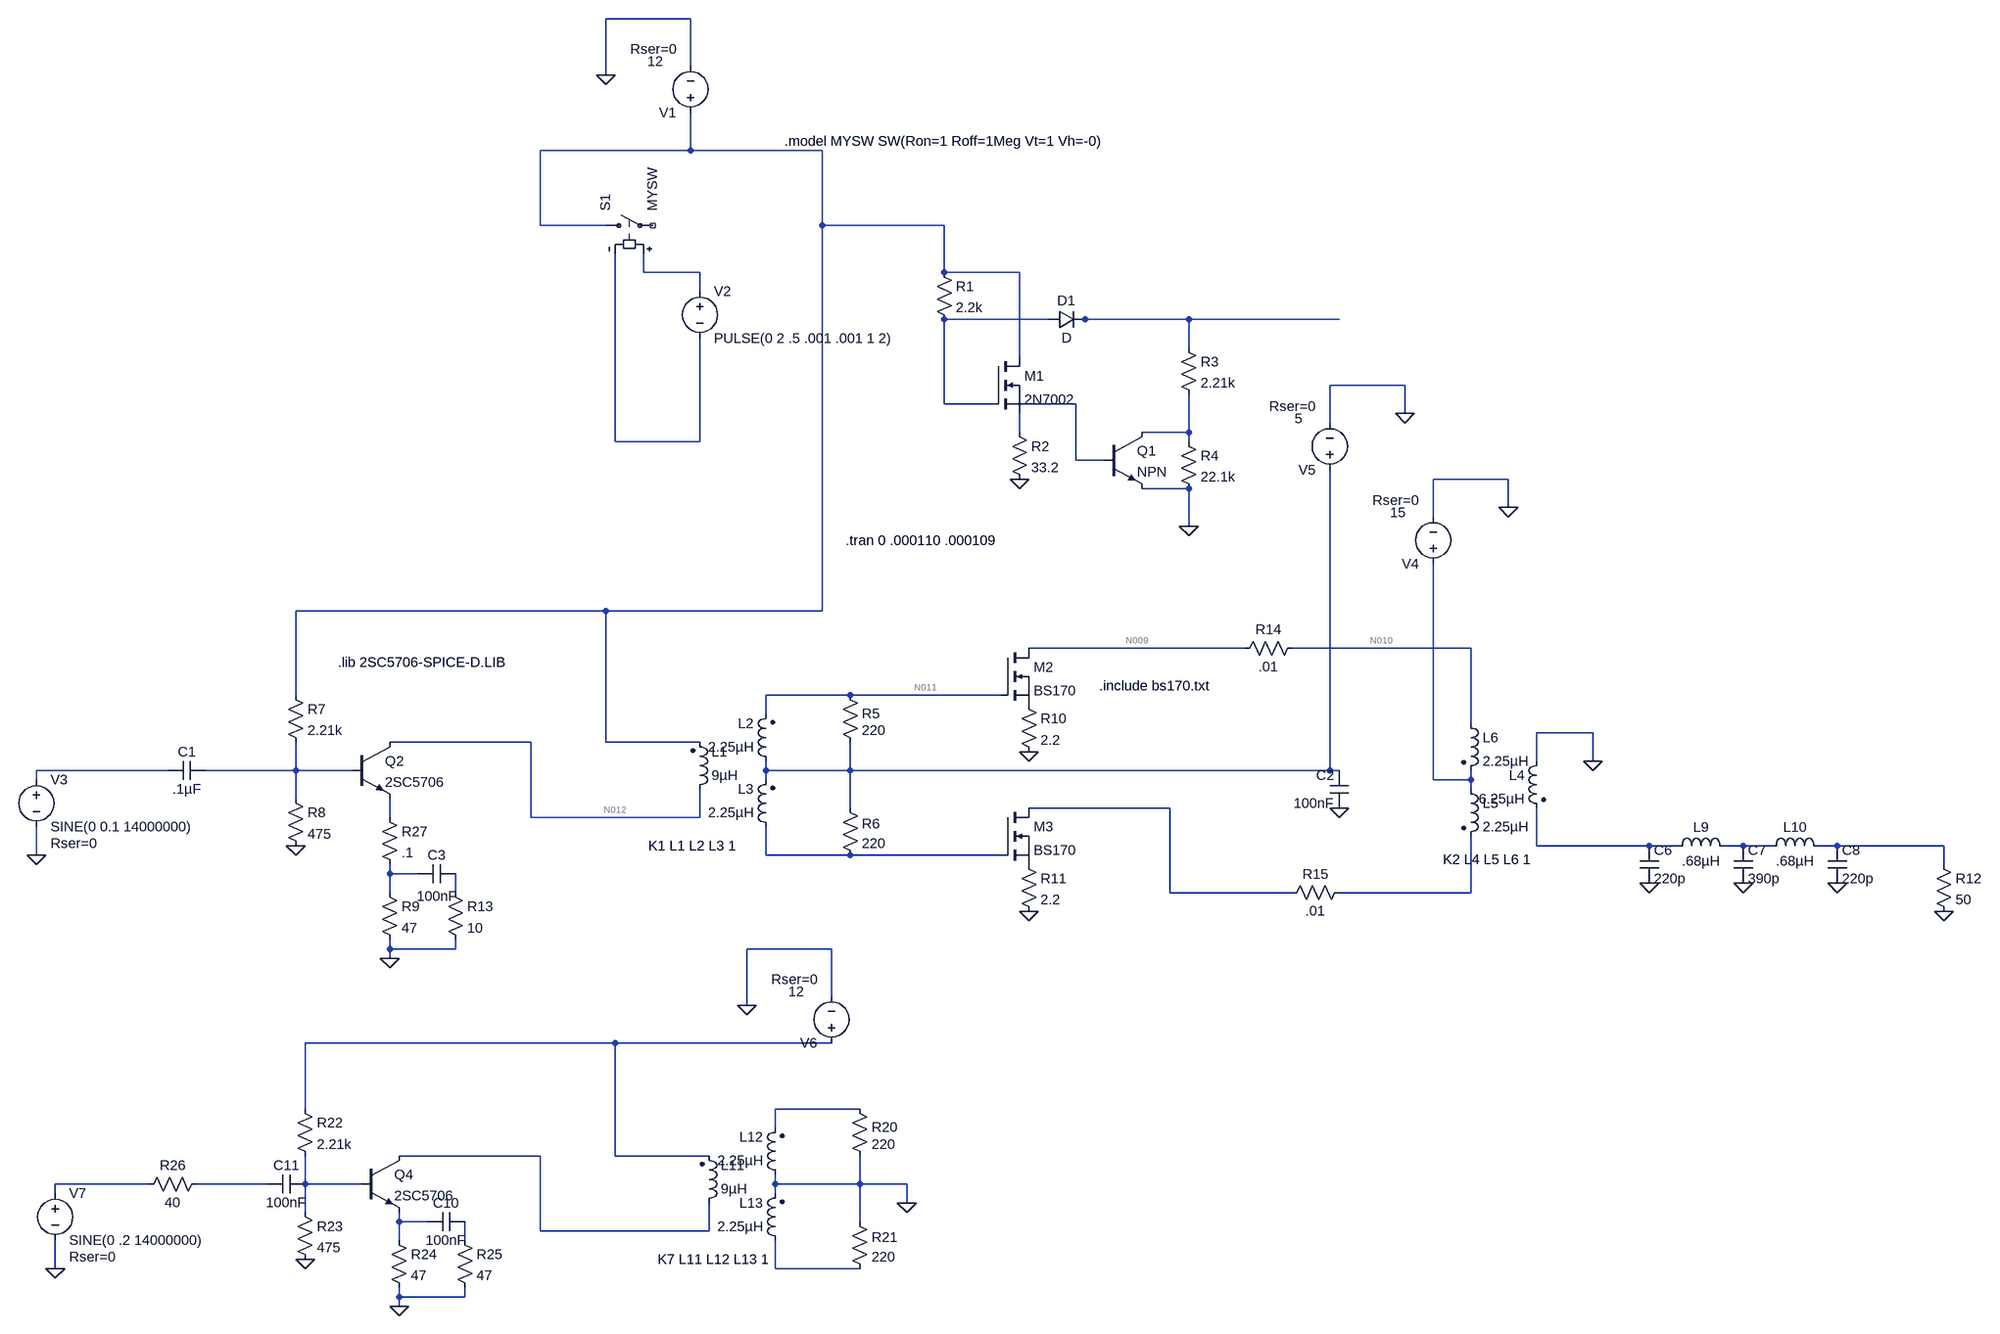
[diagram p0: schematic Amp One Stage.asc]
Amp One Stage.asc, the LTspice schematic file:
Version 4
SHEET 1 3412 1636
WIRE 1024 -608 880 -608
WIRE 1024 -528 1024 -608
WIRE 880 -512 880 -608
WIRE 1024 -384 1024 -448
WIRE 1024 -384 768 -384
WIRE 1248 -384 1024 -384
WIRE 768 -256 768 -384
WIRE 880 -256 768 -256
WIRE 1248 -256 1248 -384
WIRE 1456 -256 1248 -256
WIRE 944 -176 944 -208
WIRE 1040 -176 944 -176
WIRE 1456 -176 1456 -256
WIRE 1584 -176 1456 -176
WIRE 1040 -144 1040 -176
WIRE 1632 -96 1456 -96
WIRE 1696 -96 1680 -96
WIRE 1872 -96 1696 -96
WIRE 2128 -96 1872 -96
WIRE 1872 -48 1872 -96
WIRE 1584 -32 1584 -176
WIRE 2240 16 2112 16
WIRE 1456 48 1456 -96
WIRE 1536 48 1456 48
WIRE 1680 48 1584 48
WIRE 2240 64 2240 16
WIRE 2112 80 2112 16
WIRE 1584 96 1584 64
WIRE 1872 96 1872 32
WIRE 1872 96 1792 96
WIRE 896 112 896 -208
WIRE 1040 112 1040 -64
WIRE 1040 112 896 112
WIRE 1872 112 1872 96
WIRE 1680 144 1680 48
WIRE 1728 144 1680 144
WIRE 2416 176 2288 176
WIRE 1872 192 1792 192
WIRE 2416 224 2416 176
WIRE 2288 240 2288 176
WIRE 1872 256 1872 192
WIRE 880 400 352 400
WIRE 1248 400 1248 -256
WIRE 1248 400 880 400
WIRE 1968 464 1600 464
WIRE 2352 464 2048 464
WIRE 352 544 352 400
WIRE 1296 544 1152 544
WIRE 1552 544 1296 544
WIRE 1152 576 1152 544
WIRE 2352 592 2352 464
WIRE 2560 608 2464 608
WIRE 752 624 512 624
WIRE 880 624 880 400
WIRE 1040 624 880 624
WIRE 2464 656 2464 608
WIRE 2560 656 2560 608
WIRE 128 672 -96 672
WIRE 352 672 352 624
WIRE 352 672 192 672
WIRE 448 672 352 672
WIRE 1152 672 1152 656
WIRE 1296 672 1296 624
WIRE 1296 672 1152 672
WIRE 2112 672 2112 160
WIRE 2112 672 1296 672
WIRE 2128 672 2112 672
WIRE -96 688 -96 672
WIRE 1152 688 1152 672
WIRE 2288 688 2288 320
WIRE 2352 688 2352 672
WIRE 2352 688 2288 688
WIRE 2352 704 2352 688
WIRE 352 720 352 672
WIRE 1296 736 1296 672
WIRE 1840 736 1600 736
WIRE 512 752 512 720
WIRE 752 752 752 624
WIRE 1040 752 1040 704
WIRE 1040 752 752 752
WIRE 2464 800 2464 736
WIRE 2656 800 2464 800
WIRE 2704 800 2656 800
WIRE 2816 800 2784 800
WIRE 2864 800 2816 800
WIRE 2976 800 2944 800
WIRE 3344 800 2976 800
WIRE -96 816 -96 768
WIRE 1152 816 1152 768
WIRE 1296 816 1152 816
WIRE 1552 816 1296 816
WIRE 3344 832 3344 800
WIRE 512 848 512 832
WIRE 560 848 512 848
WIRE 512 880 512 848
WIRE 624 880 624 848
WIRE 1840 880 1840 736
WIRE 2048 880 1840 880
WIRE 2352 880 2352 784
WIRE 2352 880 2128 880
WIRE 512 976 512 960
WIRE 624 976 624 960
WIRE 624 976 512 976
WIRE 1264 976 1120 976
WIRE 512 992 512 976
WIRE 1264 1056 1264 976
WIRE 1120 1072 1120 976
WIRE 896 1136 368 1136
WIRE 1264 1136 896 1136
WIRE 368 1280 368 1136
WIRE 1312 1280 1168 1280
WIRE 1168 1312 1168 1280
WIRE 768 1360 528 1360
WIRE 896 1360 896 1136
WIRE 1056 1360 896 1360
WIRE 96 1408 -64 1408
WIRE 304 1408 176 1408
WIRE 368 1408 368 1360
WIRE 464 1408 368 1408
WIRE 1168 1408 1168 1392
WIRE 1312 1408 1312 1360
WIRE 1312 1408 1168 1408
WIRE 1392 1408 1312 1408
WIRE -64 1424 -64 1408
WIRE 1168 1424 1168 1408
WIRE 1392 1440 1392 1408
WIRE 368 1456 368 1408
WIRE 528 1472 528 1456
WIRE 576 1472 528 1472
WIRE 1312 1472 1312 1408
WIRE 768 1488 768 1360
WIRE 1056 1488 1056 1440
WIRE 1056 1488 768 1488
WIRE 528 1504 528 1472
WIRE 640 1504 640 1472
WIRE -64 1552 -64 1504
WIRE 1168 1552 1168 1504
WIRE 1312 1552 1168 1552
WIRE 528 1600 528 1584
WIRE 640 1600 640 1584
WIRE 640 1600 528 1600
WIRE 528 1616 528 1600
FLAG 880 -512 0
FLAG 1584 176 0
FLAG 1872 256 0
FLAG -96 816 0
FLAG 352 800 0
FLAG 512 992 0
FLAG 1600 640 0
FLAG 1600 912 0
FLAG 2560 656 0
FLAG 3344 912 0
FLAG 2416 224 0
FLAG 2128 736 0
FLAG 2240 64 0
FLAG 2656 864 0
FLAG 2816 864 0
FLAG 2976 864 0
FLAG 368 1536 0
FLAG 528 1616 0
FLAG 1120 1072 0
FLAG -64 1552 0
FLAG 1392 1440 0
SYMBOL voltage 1024 -432 R180
WINDOW 123 0 0 Left 0
WINDOW 39 24 124 Left 2
WINDOW 3 46 103 Left 2
SYMATTR SpiceLine Rser=0
SYMATTR Value 12
SYMATTR InstName V1
SYMBOL diode 1632 -80 R270
WINDOW 0 32 32 VTop 2
WINDOW 3 0 32 VBottom 2
SYMATTR InstName D1
SYMBOL nmos 1536 -32 R0
SYMATTR InstName M1
SYMATTR Value 2N7002
SYMBOL res 1440 -192 R0
SYMATTR InstName R1
SYMATTR Value 2.2k
SYMBOL res 1568 80 R0
SYMATTR InstName R2
SYMATTR Value 33.2
SYMBOL res 1856 -64 R0
SYMATTR InstName R3
SYMATTR Value 2.21k
SYMBOL res 1856 96 R0
SYMATTR InstName R4
SYMATTR Value 22.1k
SYMBOL npn 1728 96 R0
SYMATTR InstName Q1
SYMBOL sw 864 -256 R270
SYMATTR InstName S1
SYMATTR Value MYSW
SYMBOL voltage 1040 -160 R0
WINDOW 123 0 0 Left 0
WINDOW 39 0 0 Left 0
SYMATTR InstName V2
SYMATTR Value PULSE(0 2 .5 .001 .001 1 2)
SYMBOL voltage -96 672 R0
WINDOW 123 0 0 Left 0
WINDOW 39 24 124 Left 2
SYMATTR SpiceLine Rser=0
SYMATTR InstName V3
SYMATTR Value SINE(0 0.1 14000000)
SYMBOL ind2 1024 720 M180
WINDOW 0 36 80 Left 2
WINDOW 3 36 40 Left 2
SYMATTR InstName L1
SYMATTR Value 9µH
SYMATTR Type ind
SYMBOL ind2 1168 672 R180
WINDOW 0 36 80 Left 2
WINDOW 3 36 40 Left 2
SYMATTR InstName L2
SYMATTR Value 2.25µH
SYMATTR Type ind
SYMBOL ind2 1168 784 R180
WINDOW 0 36 80 Left 2
WINDOW 3 36 40 Left 2
SYMATTR InstName L3
SYMATTR Value 2.25µH
SYMATTR Type ind
SYMBOL res 1280 528 R0
WINDOW 0 36 47 Left 2
SYMATTR InstName R5
SYMATTR Value 220
SYMBOL res 1280 720 R0
WINDOW 0 36 43 Left 2
SYMATTR InstName R6
SYMATTR Value 220
SYMBOL res 336 528 R0
SYMATTR InstName R7
SYMATTR Value 2.21k
SYMBOL res 336 704 R0
SYMATTR InstName R8
SYMATTR Value 475
SYMBOL res 496 864 R0
SYMATTR InstName R9
SYMATTR Value 47
SYMBOL nmos 1552 464 R0
SYMATTR InstName M2
SYMATTR Value BS170
SYMATTR Prefix X
SYMBOL nmos 1552 736 R0
SYMATTR InstName M3
SYMATTR Value BS170
SYMATTR Prefix X
SYMBOL res 1584 544 R0
SYMATTR InstName R10
SYMATTR Value 2.2
SYMBOL res 1584 816 R0
SYMATTR InstName R11
SYMATTR Value 2.2
SYMBOL ind2 2480 640 M0
SYMATTR InstName L4
SYMATTR Value 6.25µH
SYMATTR Type ind
SYMBOL ind2 2336 688 R0
SYMATTR InstName L5
SYMATTR Value 2.25µH
SYMATTR Type ind
SYMBOL ind2 2336 576 R0
SYMATTR InstName L6
SYMATTR Value 2.25µH
SYMATTR Type ind
SYMBOL res 3328 816 R0
SYMATTR InstName R12
SYMATTR Value 50
SYMBOL voltage 2288 336 R180
WINDOW 123 0 0 Left 0
WINDOW 39 24 124 Left 2
WINDOW 3 46 103 Left 2
SYMATTR SpiceLine Rser=0
SYMATTR Value 15
SYMATTR InstName V4
SYMBOL cap 2144 736 R180
WINDOW 0 24 56 Left 2
WINDOW 3 24 8 Left 2
SYMATTR InstName C2
SYMATTR Value 100nF
SYMBOL cap 624 832 R90
WINDOW 0 0 32 VBottom 2
WINDOW 3 39 31 VTop 2
SYMATTR InstName C3
SYMATTR Value 100nF
SYMBOL res 608 864 R0
SYMATTR InstName R13
SYMATTR Value 10
SYMBOL voltage 2112 176 R180
WINDOW 123 0 0 Left 0
WINDOW 39 24 124 Left 2
WINDOW 3 46 103 Left 2
SYMATTR SpiceLine Rser=0
SYMATTR Value 5
SYMATTR InstName V5
SYMBOL npn 448 624 R0
SYMATTR InstName Q2
SYMATTR Value 2SC5706
SYMBOL res 2064 448 R90
WINDOW 0 0 56 VBottom 2
WINDOW 3 32 56 VTop 2
SYMATTR InstName R14
SYMATTR Value .01
SYMBOL res 2144 864 R90
WINDOW 0 0 56 VBottom 2
WINDOW 3 32 56 VTop 2
SYMATTR InstName R15
SYMATTR Value .01
SYMBOL cap 2640 800 R0
SYMATTR InstName C6
SYMATTR Value 220p
SYMBOL cap 2800 800 R0
SYMATTR InstName C7
SYMATTR Value 390p
SYMBOL cap 2960 800 R0
SYMATTR InstName C8
SYMATTR Value 220p
SYMBOL ind 2688 816 R270
WINDOW 0 32 56 VTop 2
WINDOW 3 5 56 VBottom 2
SYMATTR InstName L9
SYMATTR Value .68µH
SYMBOL ind 2848 816 R270
WINDOW 0 32 56 VTop 2
WINDOW 3 5 56 VBottom 2
SYMATTR InstName L10
SYMATTR Value .68µH
SYMBOL ind2 1040 1456 M180
WINDOW 0 36 80 Left 2
WINDOW 3 36 40 Left 2
SYMATTR InstName L11
SYMATTR Value 9µH
SYMATTR Type ind
SYMBOL ind2 1184 1408 R180
WINDOW 0 36 80 Left 2
WINDOW 3 36 40 Left 2
SYMATTR InstName L12
SYMATTR Value 2.25µH
SYMATTR Type ind
SYMBOL ind2 1184 1520 R180
WINDOW 0 36 80 Left 2
WINDOW 3 36 40 Left 2
SYMATTR InstName L13
SYMATTR Value 2.25µH
SYMATTR Type ind
SYMBOL res 1296 1264 R0
WINDOW 0 36 47 Left 2
SYMATTR InstName R20
SYMATTR Value 220
SYMBOL res 1296 1456 R0
WINDOW 0 36 43 Left 2
SYMATTR InstName R21
SYMATTR Value 220
SYMBOL res 352 1264 R0
SYMATTR InstName R22
SYMATTR Value 2.21k
SYMBOL res 352 1440 R0
SYMATTR InstName R23
SYMATTR Value 475
SYMBOL res 512 1488 R0
SYMATTR InstName R24
SYMATTR Value 47
SYMBOL cap 640 1456 R90
WINDOW 0 0 32 VBottom 2
WINDOW 3 32 32 VTop 2
SYMATTR InstName C10
SYMATTR Value 100nF
SYMBOL res 624 1488 R0
SYMATTR InstName R25
SYMATTR Value 47
SYMBOL npn 464 1360 R0
SYMATTR InstName Q4
SYMATTR Value 2SC5706
SYMBOL voltage 1264 1152 R180
WINDOW 123 0 0 Left 0
WINDOW 39 24 124 Left 2
WINDOW 3 46 103 Left 2
SYMATTR SpiceLine Rser=0
SYMATTR Value 12
SYMATTR InstName V6
SYMBOL voltage -64 1408 R0
WINDOW 123 0 0 Left 0
WINDOW 39 24 124 Left 2
SYMATTR SpiceLine Rser=0
SYMATTR InstName V7
SYMATTR Value SINE(0 .2 14000000)
SYMBOL cap 368 1392 R90
WINDOW 0 0 32 VBottom 2
WINDOW 3 32 32 VTop 2
SYMATTR InstName C11
SYMATTR Value 100nF
SYMBOL res 192 1392 R90
WINDOW 0 0 56 VBottom 2
WINDOW 3 32 56 VTop 2
SYMATTR InstName R26
SYMATTR Value 40
SYMBOL res 496 736 R0
SYMATTR InstName R27
SYMATTR Value .1
SYMBOL cap 192 656 R90
WINDOW 0 0 32 VBottom 2
WINDOW 3 32 32 VTop 2
SYMATTR InstName C1
SYMATTR Value .1µF
TEXT 1288 280 Left 2 !.tran 0 .000110 .000109
TEXT 1184 -400 Left 2 !.model MYSW SW(Ron=1 Roff=1Meg Vt=1 Vh=-0)
TEXT 952 800 Left 2 !K1 L1 L2 L3 1
TEXT 2456 824 Right 2 !K2 L4 L5 L6 1
TEXT 1720 528 Left 2 !.include bs170.txt
TEXT 424 488 Left 2 !.lib 2SC5706-SPICE-D.LIB
TEXT 968 1536 Left 2 !K7 L11 L12 L13 1

The netlist it stands for:
* Amp One Stage.asc
V1 N001 0 12 Rser=0
D1 N003 N004 D
M1 N001 N003 N006 N006 2N7002
R1 N001 N003 2.2k
R2 N006 0 33.2
R3 N004 N007 2.21k
R4 N007 0 22.1k
Q1 N007 N005 0 0 NPN
S1 N001 NC_01 N002 N008 MYSW
V2 N002 N008 PULSE(0 2 .5 .001 .001 1 2)
V3 N013 0 SINE(0 0.1 14000000) Rser=0
L1 N012 N001 9µH
L2 N015 N011 2.25µH
L3 N022 N015 2.25µH
R5 N011 N015 220
R6 N015 N022 220
R7 N001 N014 2.21k
R8 N014 0 475
R9 N023 0 47
XM2 N009 N011 P001 BS170  ; pins D G S
XM3 N017 N022 P002 BS170  ; pins D G S
R10 P001 0 2.2
R11 P002 0 2.2
L4 0 N019 6.25µH
L5 N016 N025 2.25µH
L6 N010 N016 2.25µH
R12 N021 0 50
V4 N016 0 15 Rser=0
C2 0 N015 100nF
C3 N024 N023 100nF
R13 N024 0 10
V5 N015 0 5 Rser=0
Q2 N012 N014 N018 0 2SC5706
R14 N010 N009 .01
R15 N025 N017 .01
C6 N019 0 220p
C7 N020 0 390p
C8 N021 0 220p
L9 N019 N020 .68µH
L10 N020 N021 .68µH
L11 N028 N026 9µH
L12 0 N027 2.25µH
L13 N034 0 2.25µH
R20 N027 0 220
R21 0 N034 220
R22 N026 N031 2.21k
R23 N031 0 475
R24 N032 0 47
C10 N033 N032 100nF
R25 N033 0 47
Q4 N028 N031 N032 0 2SC5706
V6 N026 0 12 Rser=0
V7 N029 0 SINE(0 .2 14000000) Rser=0
C11 N031 N030 100nF
R26 N030 N029 40
R27 N018 N023 .1
C1 N014 N013 .1µF
.model D D
.lib standard.dio
.model NPN NPN
.model PNP PNP
.lib standard.bjt
.model NMOS NMOS
.model PMOS PMOS
.lib standard.mos
.tran 0 .000110 .000109
.model MYSW SW(Ron=1 Roff=1Meg Vt=1 Vh=-0)
K1 L1 L2 L3 1
K2 L4 L5 L6 1
.include bs170.txt
.lib 2SC5706-SPICE-D.LIB
K7 L11 L12 L13 1
.backanno
.end

* Results of the author's LTspice run, read from the files saved beside the schematic
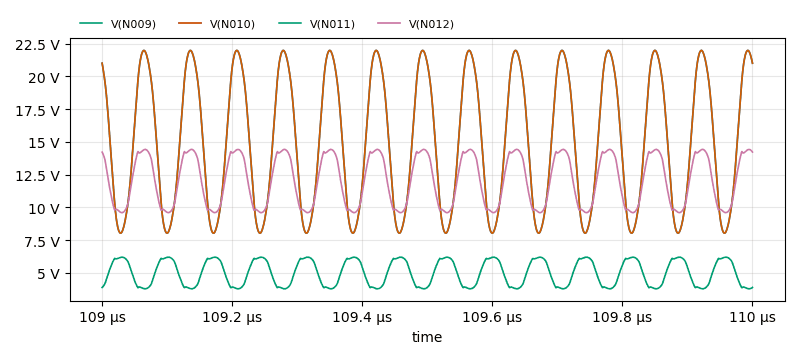
[diagram p1: Transient Analysis of Amp One Stage.asc, plotted from the saved traces]
* Transient Analysis, 1 run:
*   V(N009): min 8.027 V, max 21.98 V, average 15 V, rms 15.84 V, last 21 V
*   V(N010): min 8.032 V, max 21.98 V, average 15 V, rms 15.84 V, last 21 V
*   V(N011): min 3.788 V, max 6.201 V, average 5 V, rms 5.088 V, last 3.891 V
*   V(N012): min 9.597 V, max 14.42 V, average 12 V, rms 12.15 V, last 14.22 V